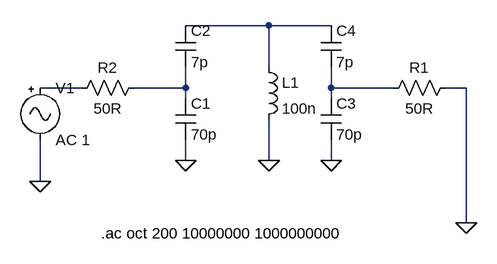
[diagram p0: schematic RF-bandpass-filter.asc]
RF-bandpass-filter.asc, the LTspice schematic file:
Version 4
SHEET 1 880 680
WIRE 240 64 112 64
WIRE 336 64 240 64
WIRE 240 128 240 64
WIRE -48 160 -112 160
WIRE 112 160 112 128
WIRE 112 160 32 160
WIRE 336 160 336 128
WIRE 432 160 336 160
WIRE 544 160 512 160
WIRE 112 176 112 160
WIRE 336 176 336 160
WIRE 112 272 112 240
WIRE 240 272 240 208
WIRE 336 272 336 240
WIRE -112 304 -112 240
WIRE 544 368 544 160
FLAG 112 272 0
FLAG 240 272 0
FLAG 336 272 0
FLAG -112 304 0
FLAG 544 368 0
SYMBOL cap 96 176 R0
SYMATTR InstName C1
SYMATTR Value 70p
SYMBOL cap 96 64 R0
SYMATTR InstName C2
SYMATTR Value 7p
SYMBOL ind 224 112 R0
SYMATTR InstName L1
SYMATTR Value 100n
SYMBOL cap 320 176 R0
SYMATTR InstName C3
SYMATTR Value 70p
SYMBOL cap 320 64 R0
SYMATTR InstName C4
SYMATTR Value 7p
SYMBOL res 528 144 R90
WINDOW 0 0 56 VBottom 2
WINDOW 3 32 56 VTop 2
SYMATTR InstName R1
SYMATTR Value 50R
SYMBOL res 48 144 R90
WINDOW 0 0 56 VBottom 2
WINDOW 3 32 56 VTop 2
SYMATTR InstName R2
SYMATTR Value 50R
SYMBOL Misc\\signal -112 144 R0
SYMATTR InstName V1
SYMATTR Value AC 1
TEXT -18 384 Left 2 !.ac oct 200 10000000 1000000000

The netlist it stands for:
* RF-bandpass-filter.asc
C1 N003 0 70p
C2 N001 N003 7p
L1 N001 0 100n
C3 N004 0 70p
C4 N001 N004 7p
R1 0 N004 50R
R2 N003 N002 50R
V1 N002 0 AC 1
.ac oct 200 10000000 1000000000
.backanno
.end